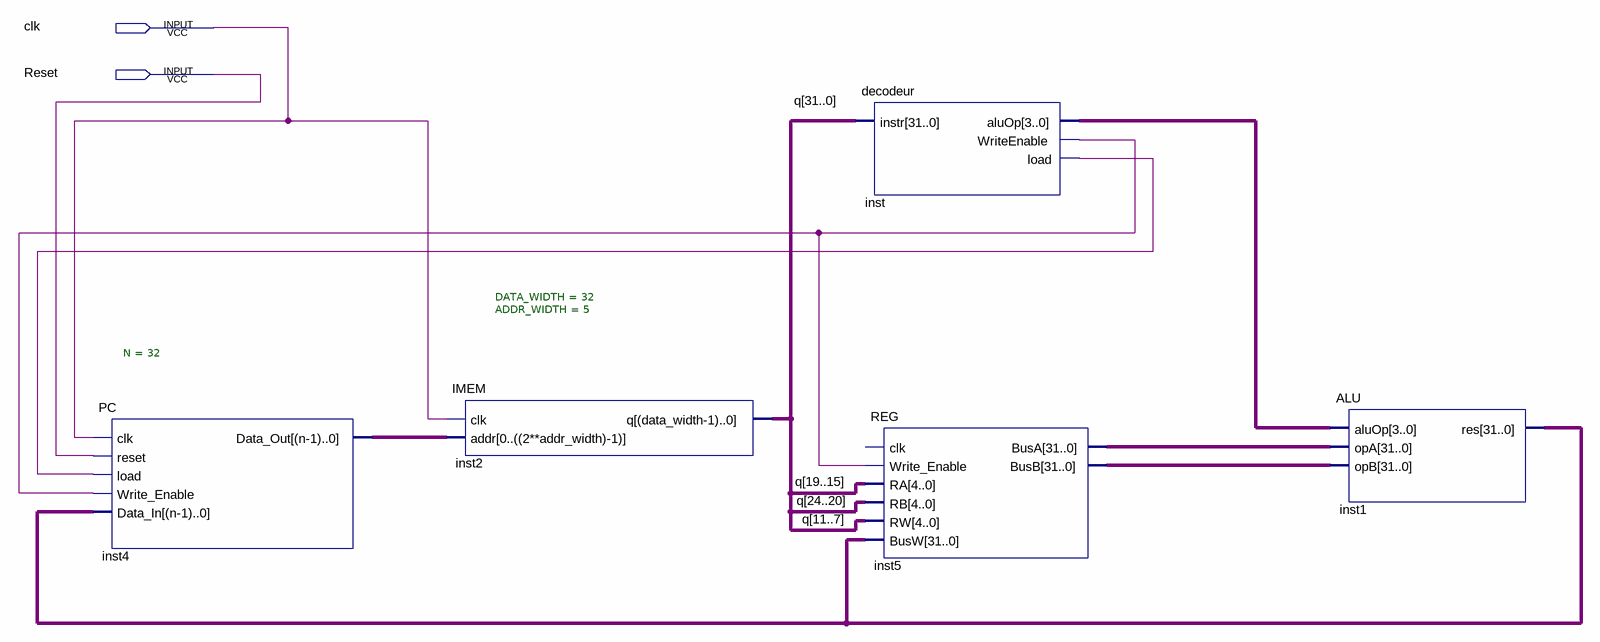
[diagram p0: schematic sheet]
// Quartus schematic Architecture.bdf as structural Verilog: 5 symbols, 2 pins
module Architecture (
  input  clk,
  input  Reset
);

  wire inst_load, inst_writeenable;
  wire [3:0] inst_aluop;
  wire [31:0] inst1_res, inst4_data_out, inst5_busa, inst5_busb, q;

  PC #(.N(32)) inst4 (
    .clk(clk), .reset(Reset), .load(inst_load), .Write_Enable(inst_writeenable), .Data_In(inst1_res),
    .Data_Out(inst4_data_out));
  IMEM #(.DATA_WIDTH(32), .ADDR_WIDTH(5)) inst2 (.clk(clk), .addr(inst4_data_out), .q(q));
  decodeur inst (.instr(q), .aluOp(inst_aluop), .WriteEnable(inst_writeenable), .load(inst_load));
  REG inst5 (
    .Write_Enable(inst_writeenable), .RA(q[19:15]), .RB(q[24:20]), .RW(q[11:7]), .BusW(inst1_res),
    .BusA(inst5_busa), .BusB(inst5_busb));  // open: clk
  ALU inst1 (.aluOp(inst_aluop), .opA(inst5_busa), .opB(inst5_busb), .res(inst1_res));
endmodule
